# Altium project Microneedle_Patch.PrjPcb
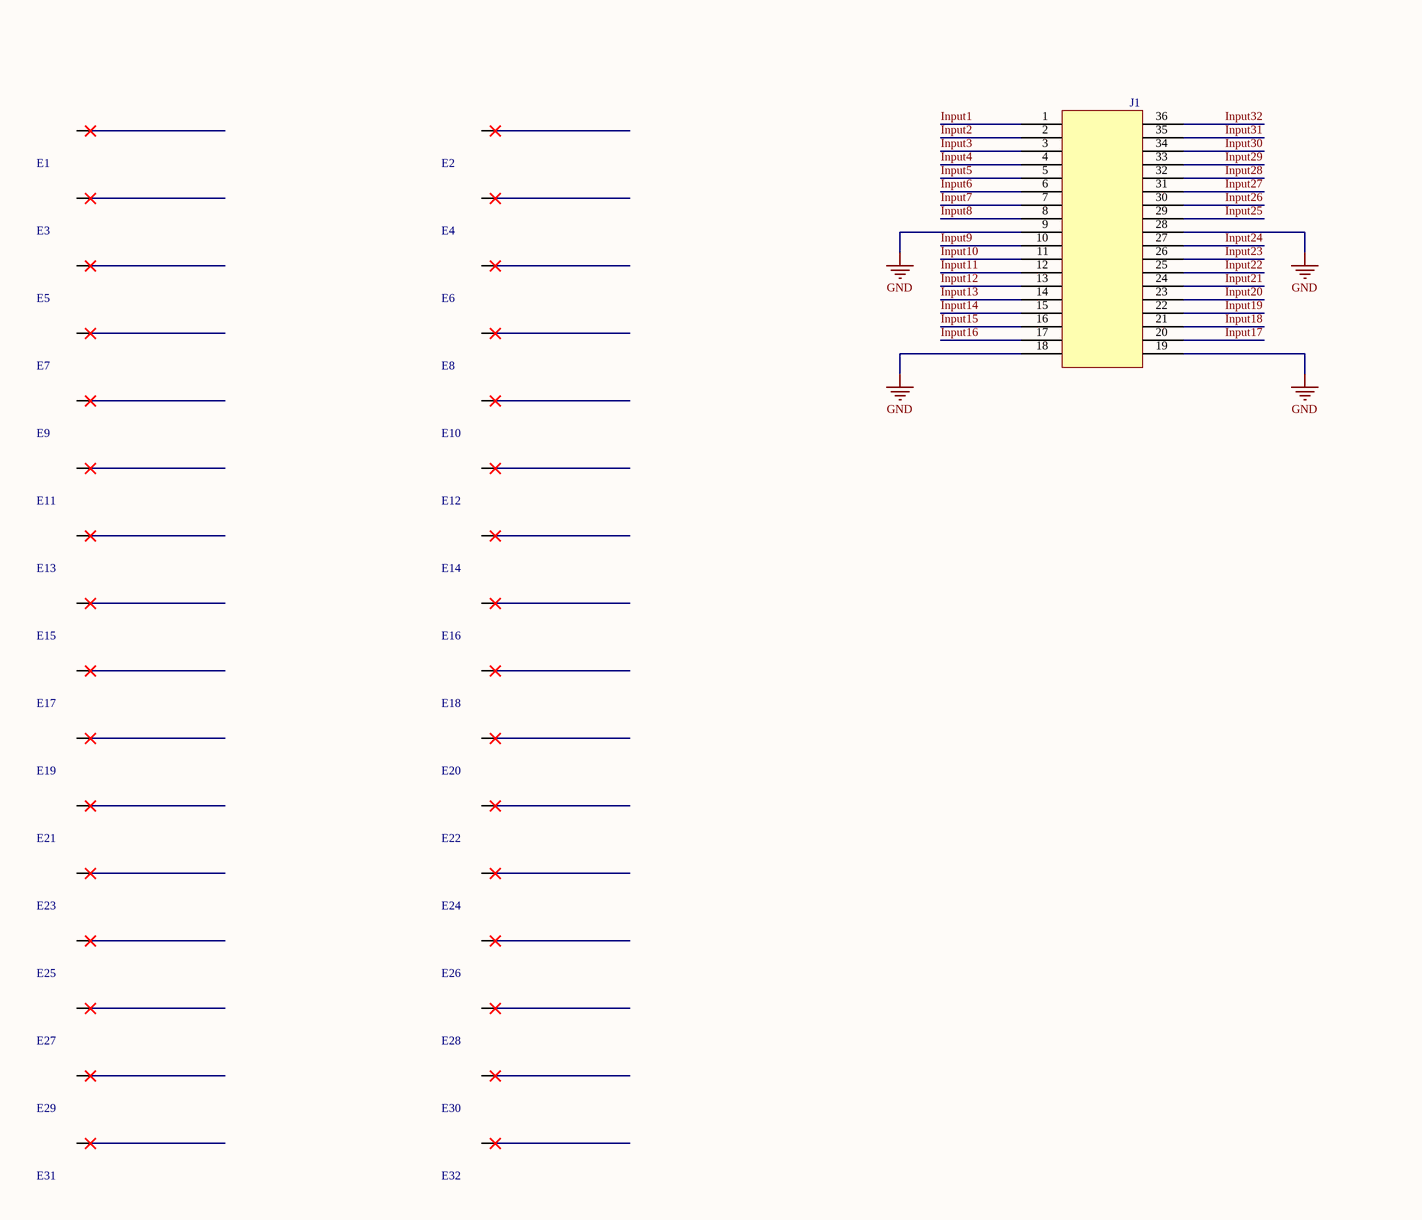
[diagram p0: Main.SchDoc, left]
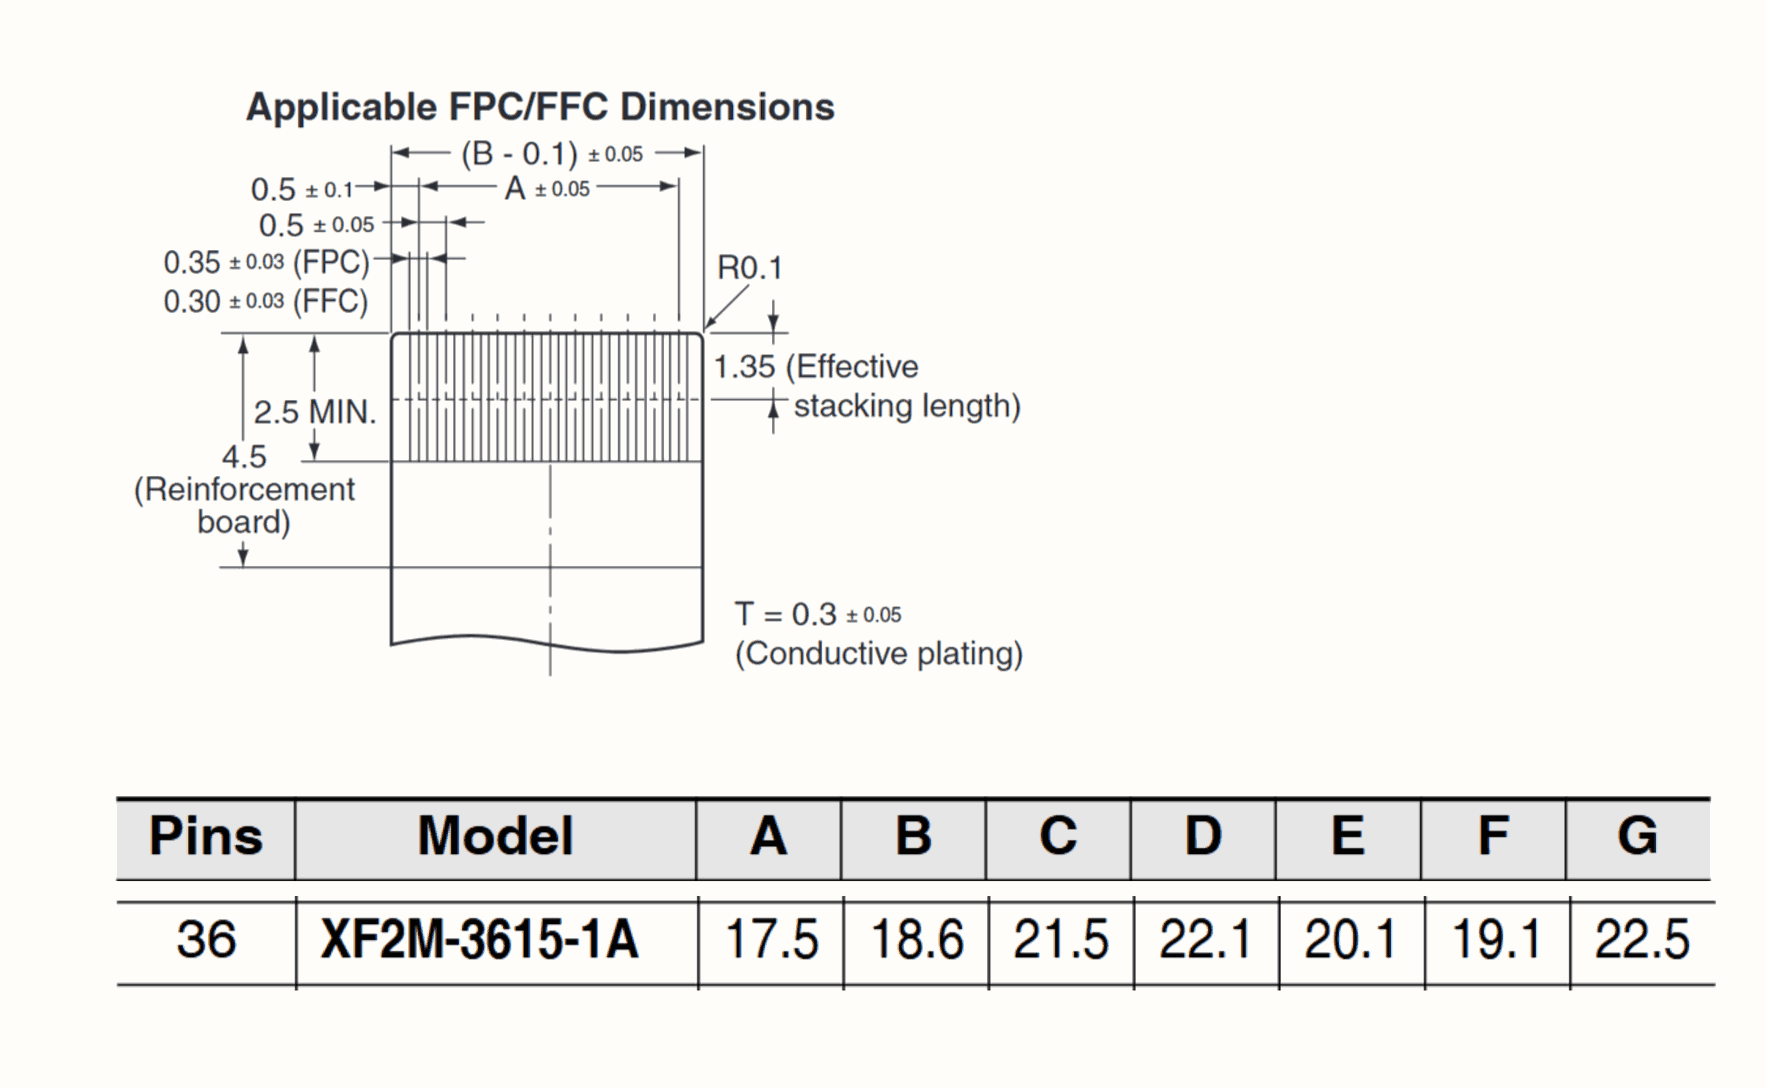
[diagram p1: Main.SchDoc, right]
Project_Date: 2026-05-01; Project_Designer1: Olivier Bergeron; Project_Global: UHD-EMG; Project_Group: SBioML; Project_Name: Microneedle Electrode Patch; Project_Revision: 1.020; Project_Stencil_Bot_Thickness: 0.1 MM; Project_Stencil_Top_Thickness: 0.1 MM
1 sheet, 33 parts. Net scope: flat (ports and power ports of the same name join across sheets).
Board file: Microneedle_Patch.PcbDoc

## Sheet Main.SchDoc
size Tabloid; SheetNumber: 1; SheetTotal: 1; Sheet_Name: Main schematics file; Size: 11x17

### Parts
E1  2.5 mm  [PCBComponent_1]  (value not drawn)
E2  2.5 mm  [PCBComponent_1]  (value not drawn)
E3  2.5 mm  [PCBComponent_1]  (value not drawn)
E4  2.5 mm  [PCBComponent_1]  (value not drawn)
E5  2.5 mm  [PCBComponent_1]  (value not drawn)
E6  2.5 mm  [PCBComponent_1]  (value not drawn)
E7  2.5 mm  [PCBComponent_1]  (value not drawn)
E8  2.5 mm  [PCBComponent_1]  (value not drawn)
E9  2.5 mm  [PCBComponent_1]  (value not drawn)
E10  2.5 mm  [PCBComponent_1]  (value not drawn)
E11  2.5 mm  [PCBComponent_1]  (value not drawn)
E12  2.5 mm  [PCBComponent_1]  (value not drawn)
E13  2.5 mm  [PCBComponent_1]  (value not drawn)
E14  2.5 mm  [PCBComponent_1]  (value not drawn)
E15  2.5 mm  [PCBComponent_1]  (value not drawn)
E16  2.5 mm  [PCBComponent_1]  (value not drawn)
E17  2.5 mm  [PCBComponent_1]  (value not drawn)
E18  2.5 mm  [PCBComponent_1]  (value not drawn)
E19  2.5 mm  [PCBComponent_1]  (value not drawn)
E20  2.5 mm  [PCBComponent_1]  (value not drawn)
E21  2.5 mm  [PCBComponent_1]  (value not drawn)
E22  2.5 mm  [PCBComponent_1]  (value not drawn)
E23  2.5 mm  [PCBComponent_1]  (value not drawn)
E24  2.5 mm  [PCBComponent_1]  (value not drawn)
E25  2.5 mm  [PCBComponent_1]  (value not drawn)
E26  2.5 mm  [PCBComponent_1]  (value not drawn)
E27  2.5 mm  [PCBComponent_1]  (value not drawn)
E28  2.5 mm  [PCBComponent_1]  (value not drawn)
E29  2.5 mm  [PCBComponent_1]  (value not drawn)
E30  2.5 mm  [PCBComponent_1]  (value not drawn)
E31  2.5 mm  [PCBComponent_1]  (value not drawn)
E32  2.5 mm  [PCBComponent_1]  (value not drawn)
J1  XF2M-3615-1A  [CONN_FPC_2X18_0MM5]  (value not drawn)

### Nets
GND: J1.9 J1.18 J1.19 J1.28
Input1: J1.1
Input2: J1.2
Input3: J1.3
Input4: J1.4
Input5: J1.5
Input6: J1.6
Input7: J1.7
Input8: J1.8
Input9: J1.10
Input10: J1.11
Input11: J1.12
Input12: J1.13
Input13: J1.14
Input14: J1.15
Input15: J1.16
Input16: J1.17
Input17: J1.20
Input18: J1.21
Input19: J1.22
Input20: J1.23
Input21: J1.24
Input22: J1.25
Input23: J1.26
Input24: J1.27
Input25: J1.29
Input26: J1.30
Input27: J1.31
Input28: J1.32
Input29: J1.33
Input30: J1.34
Input31: J1.35
Input32: J1.36

Not connected (* = marked no-connect by the designer): E1 1(E)*; E2 1(E)*; E3 1(E)*; E4 1(E)*; E5 1(E)*; E6 1(E)*; E7 1(E)*; E8 1(E)*; E9 1(E)*; E10 1(E)*; E11 1(E)*; E12 1(E)*; E13 1(E)*; E14 1(E)*; E15 1(E)*; E16 1(E)*; E17 1(E)*; E18 1(E)*; E19 1(E)*; E20 1(E)*; E21 1(E)*; E22 1(E)*; E23 1(E)*; E24 1(E)*; E25 1(E)*; E26 1(E)*; E27 1(E)*; E28 1(E)*; E29 1(E)*; E30 1(E)*; E31 1(E)*; E32 1(E)*

### Notes on the sheet
- Sheet Name
- Project Title
- Global Project
- Size
- Group
- Revision
- Date
- Sheet
- of
- Filename
- Designers

### Library data of the parts
E1-E32 = SENSE_UNEEDLE: Microneedle electrode - 2.5 mm diameter
J1 = CONN_FPC_2X18_0MM5: FPC Connector - FPC Side. 0.5 mm pitch / Compatible with XF2M-3615-1A; GRAMS Lib Spec: 2.7